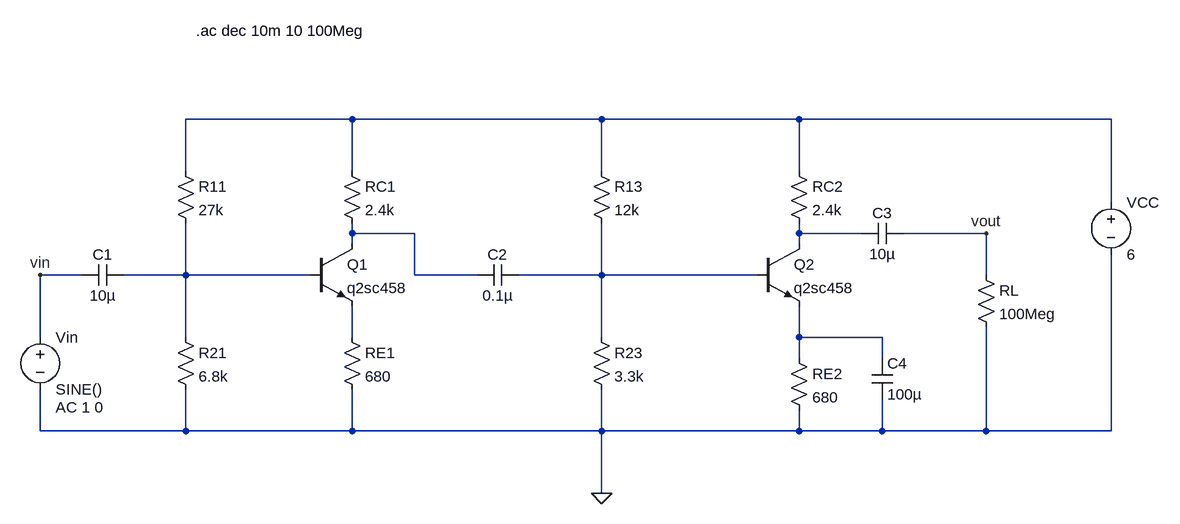
[diagram p0: schematic 3-1.asc]
3-1.asc, the LTspice schematic file:
Version 4
SHEET 1 1528 680
WIRE 288 16 32 16
WIRE 672 16 288 16
WIRE 976 16 672 16
WIRE 1456 16 976 16
WIRE 32 96 32 16
WIRE 288 96 288 16
WIRE 672 96 672 16
WIRE 976 96 976 16
WIRE 1456 144 1456 16
WIRE 288 192 288 176
WIRE 384 192 288 192
WIRE 976 192 976 176
WIRE 1072 192 976 192
WIRE 1264 192 1136 192
WIRE 288 208 288 192
WIRE 976 208 976 192
WIRE -128 256 -192 256
WIRE 32 256 32 176
WIRE 32 256 -64 256
WIRE 224 256 32 256
WIRE 384 256 384 192
WIRE 480 256 384 256
WIRE 672 256 672 176
WIRE 672 256 544 256
WIRE 912 256 672 256
WIRE 1264 256 1264 192
WIRE -192 352 -192 256
WIRE 32 352 32 256
WIRE 288 352 288 304
WIRE 672 352 672 256
WIRE 976 352 976 304
WIRE 1104 352 976 352
WIRE 976 384 976 352
WIRE 1104 384 1104 352
WIRE -192 496 -192 432
WIRE 32 496 32 432
WIRE 32 496 -192 496
WIRE 288 496 288 432
WIRE 288 496 32 496
WIRE 672 496 672 432
WIRE 672 496 288 496
WIRE 976 496 976 464
WIRE 976 496 672 496
WIRE 1104 496 1104 448
WIRE 1104 496 976 496
WIRE 1264 496 1264 336
WIRE 1264 496 1104 496
WIRE 1456 496 1456 224
WIRE 1456 496 1264 496
WIRE 672 592 672 496
FLAG 672 592 0
FLAG 1264 192 vout
FLAG -192 256 vin
SYMBOL voltage -192 336 R0
WINDOW 123 24 124 Left 2
WINDOW 39 0 0 Left 0
SYMATTR Value2 AC 1 0
SYMATTR InstName Vin
SYMATTR Value SINE()
SYMBOL cap -64 240 R90
WINDOW 0 0 32 VBottom 2
WINDOW 3 32 32 VTop 2
SYMATTR InstName C1
SYMATTR Value 10µ
SYMBOL res 16 80 R0
SYMATTR InstName R11
SYMATTR Value 27k
SYMBOL res 16 336 R0
SYMATTR InstName R21
SYMATTR Value 6.8k
SYMBOL res 272 80 R0
SYMATTR InstName RC1
SYMATTR Value 2.4k
SYMBOL npn 224 208 R0
SYMATTR InstName Q1
SYMATTR Value q2sc458
SYMBOL res 272 336 R0
SYMATTR InstName RE1
SYMATTR Value 680
SYMBOL cap 544 240 R90
WINDOW 0 0 32 VBottom 2
WINDOW 3 32 32 VTop 2
SYMATTR InstName C2
SYMATTR Value 0.1µ
SYMBOL res 656 80 R0
SYMATTR InstName R13
SYMATTR Value 12k
SYMBOL res 656 336 R0
SYMATTR InstName R23
SYMATTR Value 3.3k
SYMBOL res 960 80 R0
SYMATTR InstName RC2
SYMATTR Value 2.4k
SYMBOL npn 912 208 R0
SYMATTR InstName Q2
SYMATTR Value q2sc458
SYMBOL res 960 368 R0
SYMATTR InstName RE2
SYMATTR Value 680
SYMBOL cap 1088 384 R0
SYMATTR InstName C4
SYMATTR Value 100µ
SYMBOL cap 1136 176 R90
WINDOW 0 0 32 VBottom 2
WINDOW 3 32 32 VTop 2
SYMATTR InstName C3
SYMATTR Value 10µ
SYMBOL res 1248 240 R0
SYMATTR InstName RL
SYMATTR Value 100Meg
SYMBOL voltage 1456 128 R0
WINDOW 123 0 0 Left 0
WINDOW 39 0 0 Left 0
SYMATTR InstName VCC
SYMATTR Value 6
TEXT 48 -120 Left 2 !.ac dec 10m 10 100Meg

The netlist it stands for:
* 3-1.asc
Vin vin 0 SINE() AC 1 0
C1 N004 vin 10µ
R11 N001 N004 27k
R21 N004 0 6.8k
RC1 N001 N002 2.4k
Q1 N002 N004 N006 0 q2sc458
RE1 N006 0 680
C2 N005 N002 0.1µ
R13 N001 N005 12k
R23 N005 0 3.3k
RC2 N001 N003 2.4k
Q2 N003 N005 N007 0 q2sc458
RE2 N007 0 680
C4 N007 0 100µ
C3 vout N003 10µ
RL vout 0 100Meg
VCC N001 0 6
.model NPN NPN
.model PNP PNP
.lib standard.bjt
.ac dec 10m 10 100Meg
.backanno
.end